# Altium project Temp_sense_Project 2.0.PrjPcb
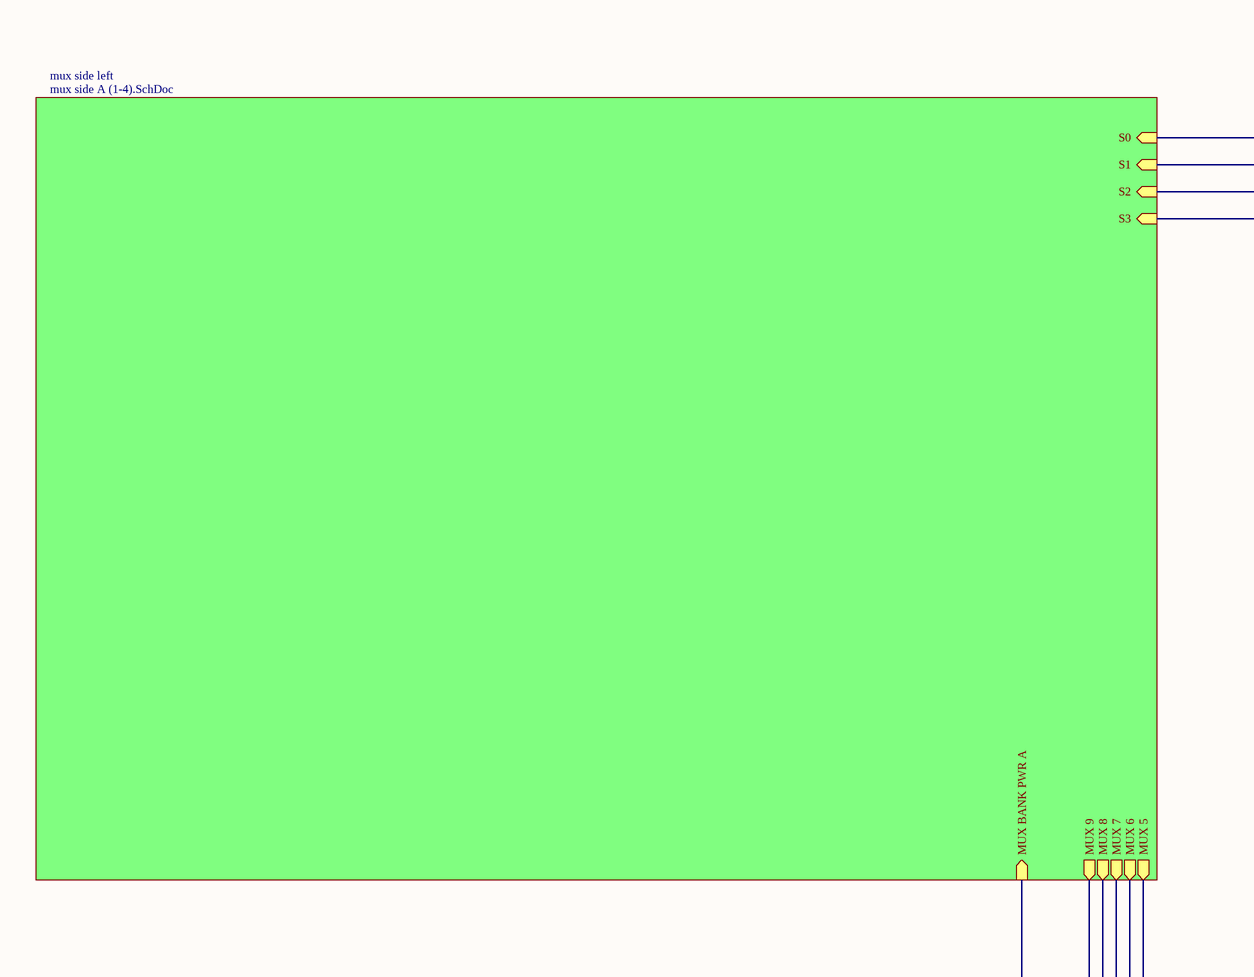
[diagram p0: temp sense 2.0 top.SchDoc, top left]
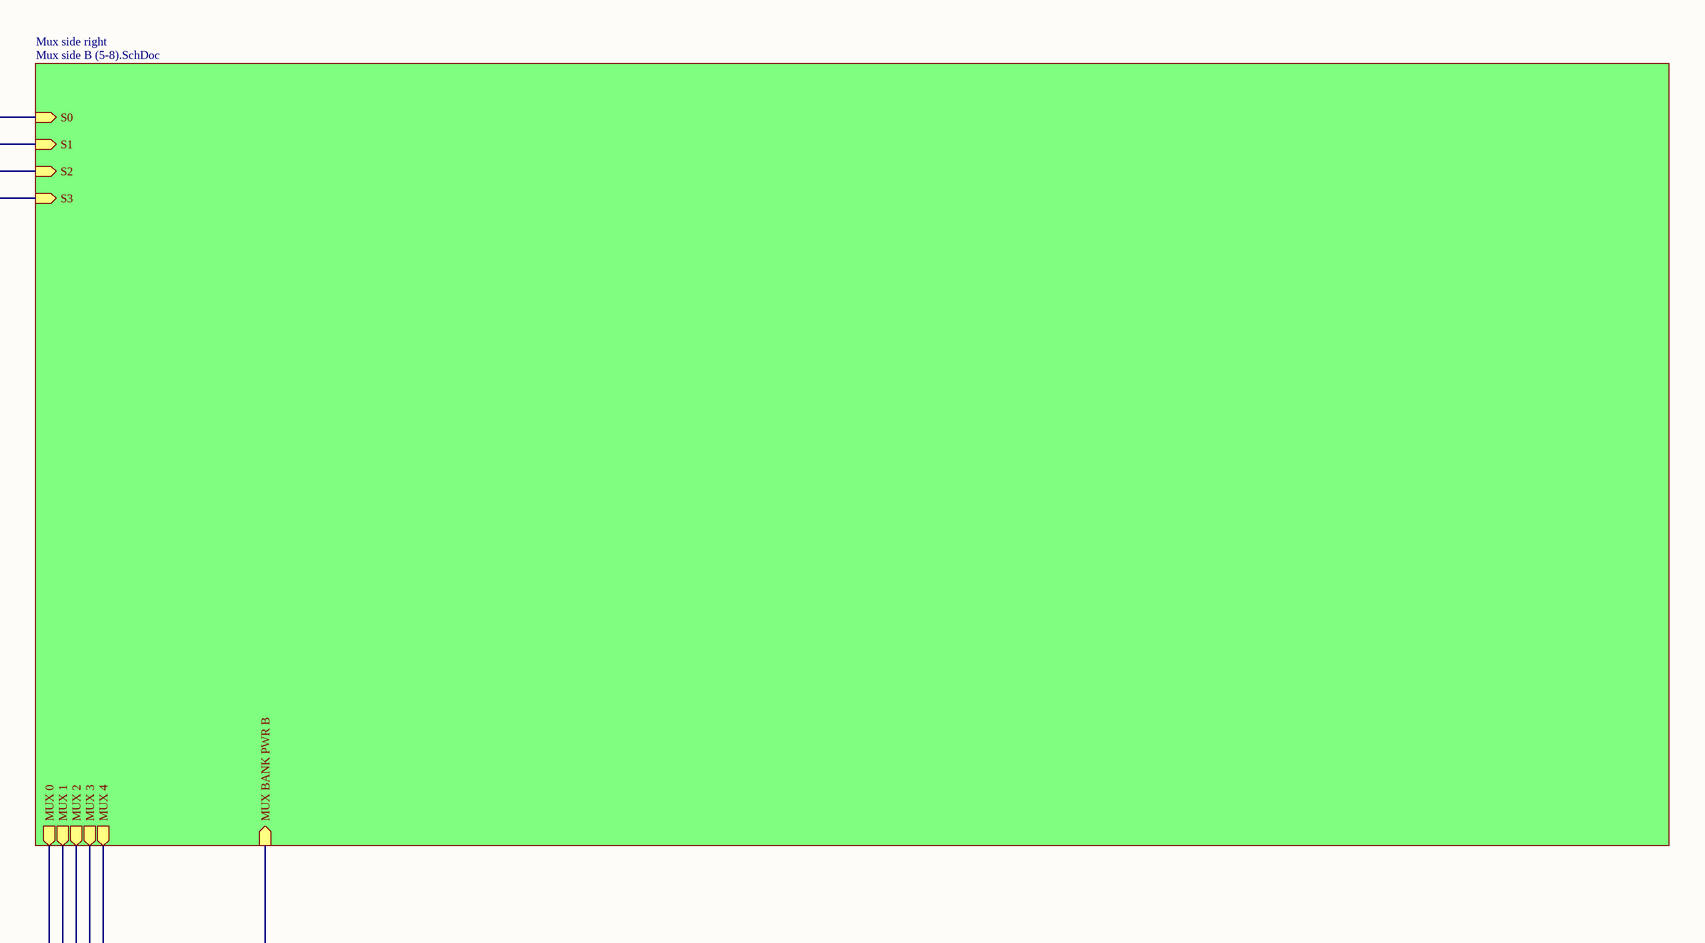
[diagram p1: temp sense 2.0 top.SchDoc, top right]
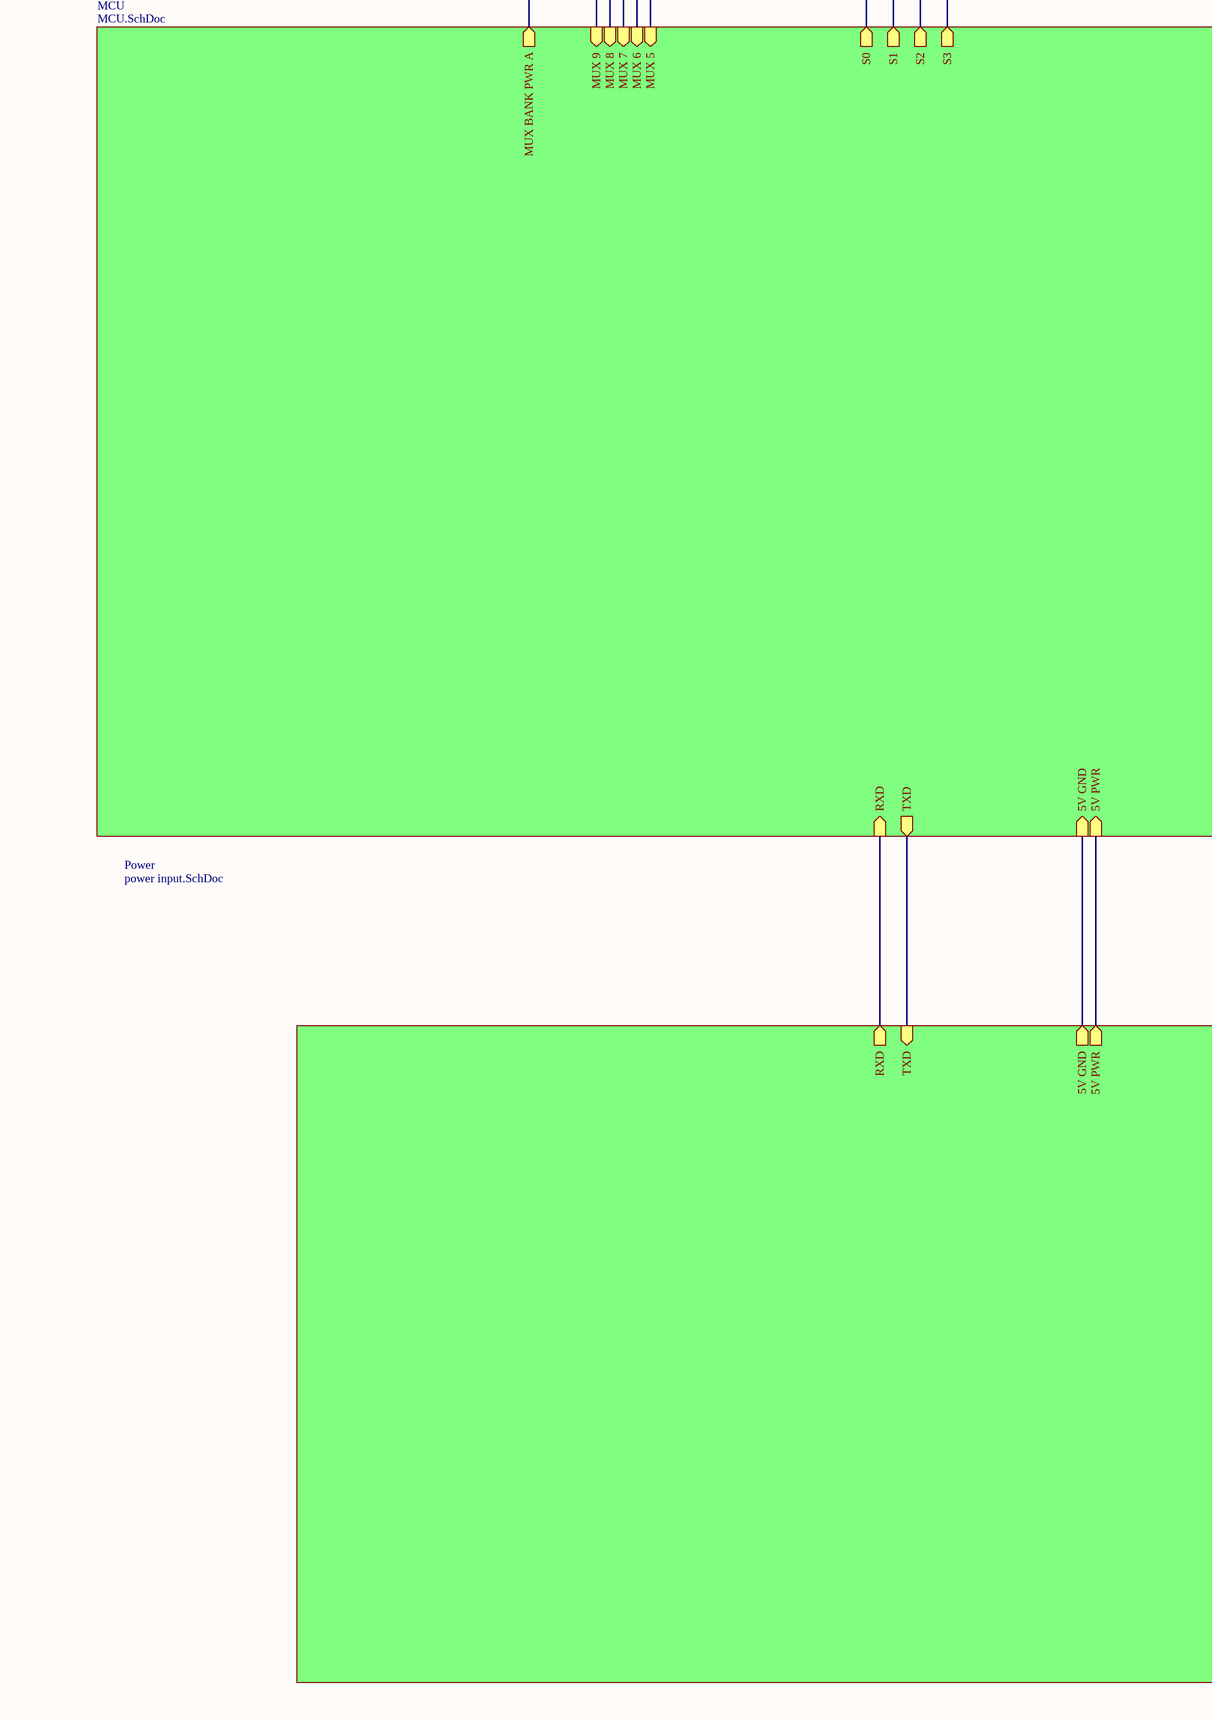
[diagram p2: temp sense 2.0 top.SchDoc, bottom left]
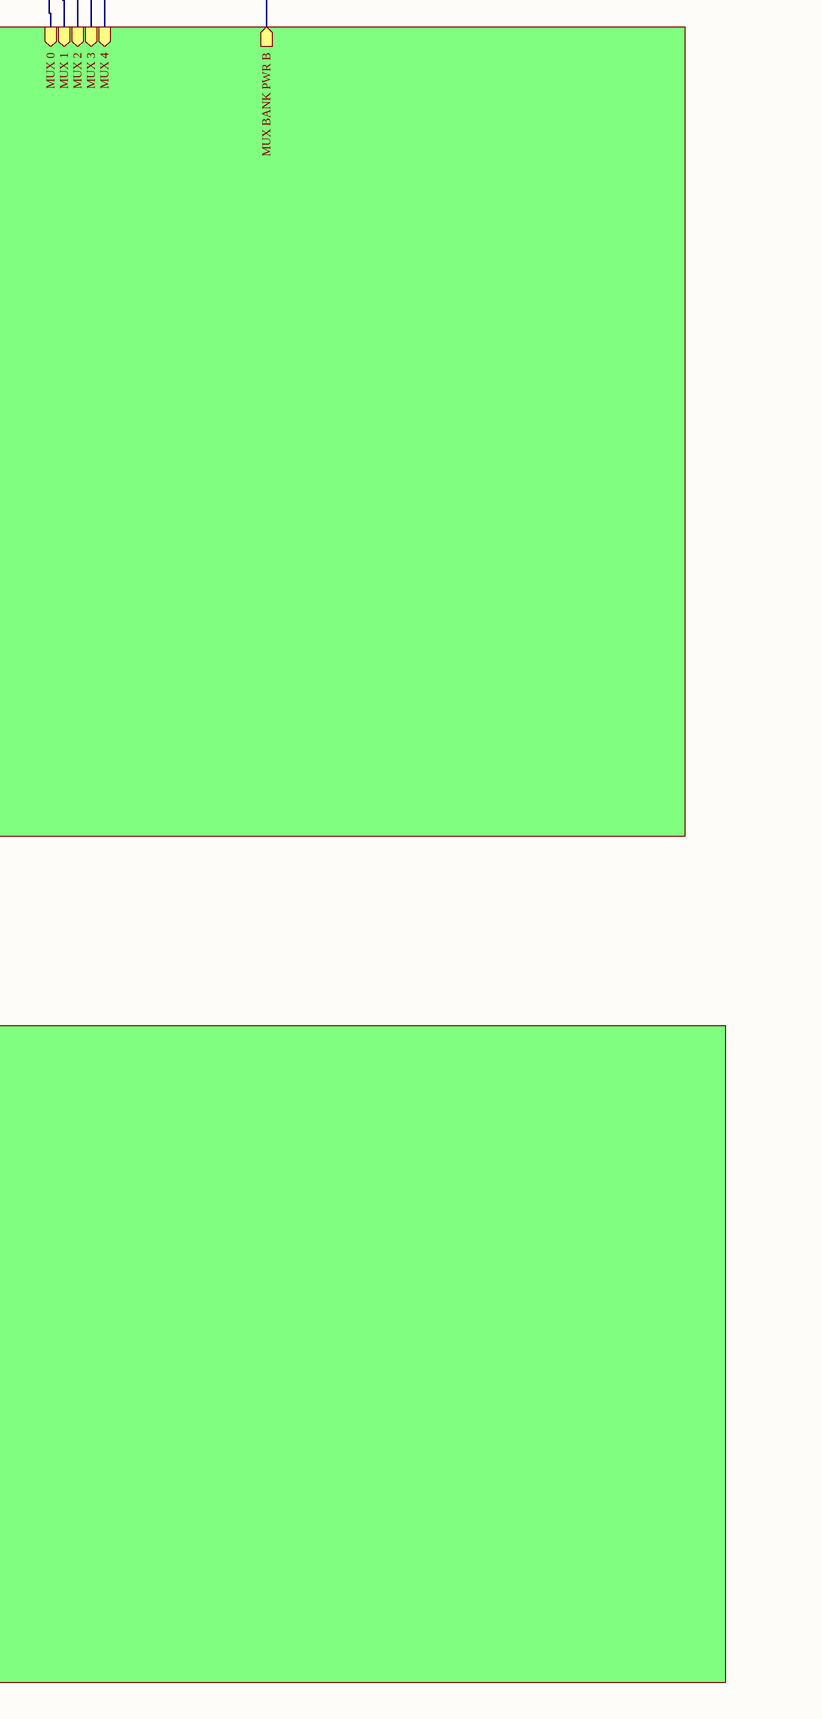
[diagram p3: temp sense 2.0 top.SchDoc, bottom right]
3 sheets, 35 parts. Net scope: hierarchical (ports join the sheet entries above them; power ports are global).
Board files: Temp_sense_Project 2.0(right angle.PcbDoc, temp sense 2.0,uhh.PcbDoc
Sheets:
  temp sense 2.0 top.SchDoc
    Power = power input.SchDoc
    MCU = MCU.SchDoc

## Sheet temp sense 2.0 top.SchDoc: 2026 Temp Sense blocks
size 863 x 558 mm; Date: 11/29/2025; Author: Mitchell Donahue; CompanyName: Lawrence Technological University; DrawnBy: Mitchell Donahue; Engineer: Mitchell Donahue; Organization: Blue Devil Motorsport; DocumentNumber: 1; Revision: 1; SheetNumber: 1; SheetTotal: 5; =Project: Temp sense; Application_BuildNumber: 1

### Sub-sheets
MCU = MCU.SchDoc: S0 (out), S1 (out), S2 (out), S3 (out), MUX 0 (in), MUX 1 (in), MUX 2 (in), MUX 3 (in), MUX 4 (in), MUX 5 (in), MUX 6 (in), MUX 7 (in), MUX 8 (in), MUX 9 (in), 5V GND (in), 5V PWR (in), MUX BANK PWR A (out), MUX BANK PWR B (out), TXD (out), RXD (in)
mux side left = mux side A (1-4).SchDoc (file not in this document): S0 (in), S1 (in), S2 (in), S3 (in), MUX 5 (out), MUX 6 (out), MUX 7 (out), MUX 8 (out), MUX 9 (out), MUX BANK PWR A (in)
Mux side right = Mux side B (5-8).SchDoc (file not in this document): S0 (in), S1 (in), S2 (in), S3 (in), MUX 0 (out), MUX 1 (out), MUX 2 (out), MUX 3 (out), MUX 4 (out), MUX BANK PWR B (in)
Power = power input.SchDoc: 5V GND (out), 5V PWR (out), RXD (out), TXD (in)

### Nets
GND: sheet Power/5V GND, sheet MCU/5V GND
NetC19_2: sheet Power/5V PWR, sheet MCU/5V PWR
NetC20_1: sheet Mux side right/MUX BANK PWR B, sheet mux side left/MUX BANK PWR A, sheet MCU/MUX BANK PWR A, sheet MCU/MUX BANK PWR B
NetU9_12: sheet Power/TXD, sheet MCU/TXD
NetU9_13: sheet Power/RXD, sheet MCU/RXD
NetU10_8: sheet mux side left/MUX 8, sheet MCU/MUX 8
NetU10_9: sheet mux side left/MUX 9, sheet MCU/MUX 9
NetU10_14: sheet Mux side right/MUX 0, sheet MCU/MUX 0
NetU10_15: sheet Mux side right/MUX 1, sheet MCU/MUX 1
NetU10_16: sheet Mux side right/MUX 2, sheet MCU/MUX 2
NetU10_17: sheet Mux side right/MUX 3, sheet MCU/MUX 3
NetU10_20: sheet Mux side right/MUX 4, sheet MCU/MUX 4
NetU10_21: sheet mux side left/MUX 5, sheet MCU/MUX 5
NetU10_22: sheet mux side left/MUX 6, sheet MCU/MUX 6
NetU10_23: sheet mux side left/MUX 7, sheet MCU/MUX 7
NetU10_29: sheet Mux side right/S3, sheet mux side left/S3, sheet MCU/S3
NetU10_55: sheet Mux side right/S0, sheet mux side left/S0, sheet MCU/S0
NetU10_56: sheet Mux side right/S2, sheet mux side left/S2, sheet MCU/S2
NetU10_57: sheet Mux side right/S1, sheet mux side left/S1, sheet MCU/S1

### Notes on the sheet
- DWG. NO.
- REV.
- SHT.
- REVISION
- DESCRIPTION
- DATE
- APPROVED
- THIS DOCUMENT AND THE DATA DISCLOSED HEREIN OR HEREWITH IS THE PROPERTY OF ALTIUM LIMITED AND MAY BE FREELY DISTRIBUTED IN WHOLE. NO RIGHTS ARE RESERVED OR EXPRESS OR IMPLIED WARANTEE GIVEN.
- ENG:
- DSN:
- APPROVALS
- PROJECT
- DOCUMENT REVISION:
- DESIGN ITEM:
- CHK:
- BOM:
- REFERENCE DOCUMENTS
- PROJECT REVISION:
- TITLE
- FAB DWG:
- PCB DWG:
- ASSY DWG:
- SCALE:
- SIZE
- D
- CAGE CODE
- FILE NAME
- DWG NO.
- SHEET
- OF
- REV

## Sheet power input.SchDoc
size 431 x 279 mm; SheetNumber: 4; SheetTotal: 5
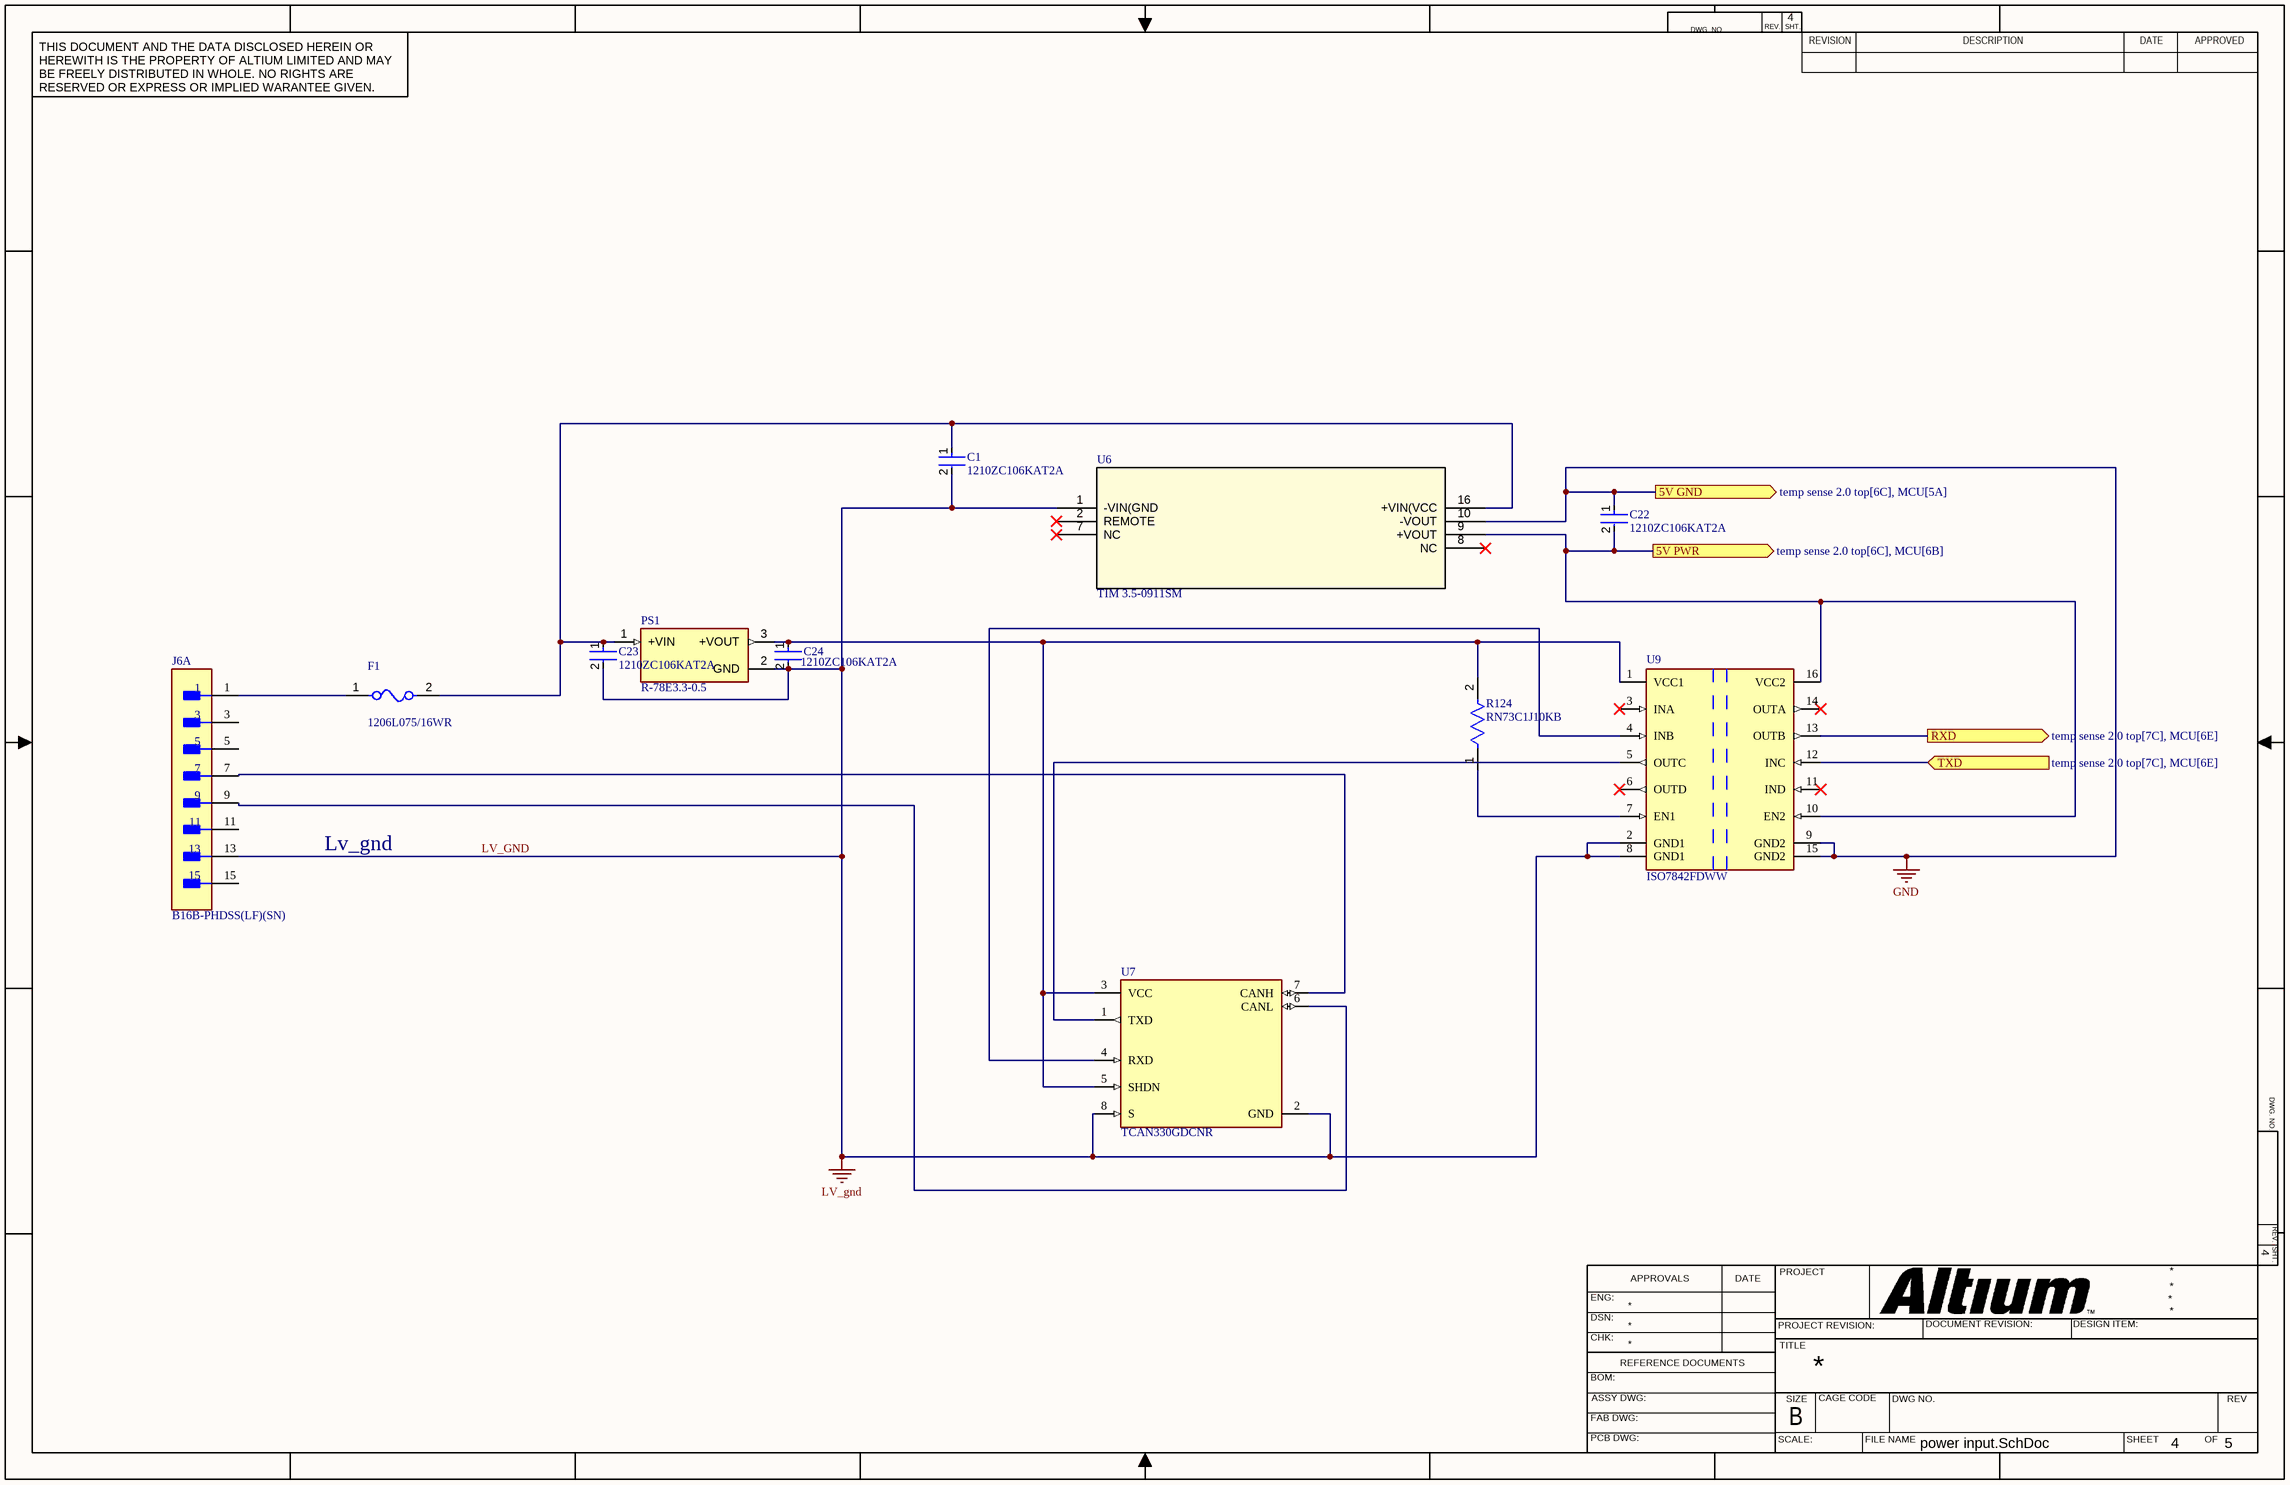
[diagram p4: power input.SchDoc]

### Parts
C1  1210ZC106KAT2A  [FP-1210-L_3_3_0_4-W_2_5_0-IPC_A]
C22  1210ZC106KAT2A  [FP-1210-L_3_3_0_4-W_2_5_0-IPC_A]
C23  1210ZC106KAT2A  [FP-1210-L_3_3_0_4-W_2_5_0-IPC_A]
C24  1210ZC106KAT2A  [FP-1210-L_3_3_0_4-W_2_5_0-IPC_A]
F1  1206L075/16WR  [FP-1206L-MFG]
J6  B16B-PHDSS(LF)(SN)  [FP-B16B-PHDSS_LF_SN-MFG]  (part A of 2)
PS1  R-78E3.3-0.5  [CONV_R-78E3.3-0.5]
R124  RN73C1J10KB  [FP-RN731J-MFG]
U6  TIM 3.5-0911SM  [TIM 3.5SM SINGLE_TRP]
U7  TCAN330GDCNR  [FP-DCN0008A-MFG]
U9  ISO7842FDWW  [FP-DWW0016A-MFG]

### Ports
5V GND (out, see temp sense 2.0 top[6C], MCU[5A]), 5V PWR (out, see temp sense 2.0 top[6C], MCU[6B]), RXD (out, see temp sense 2.0 top[7C], MCU[6E]), TXD (in, see temp sense 2.0 top[7C], MCU[6E])

### Nets
GND: C22.1 U6.10(-VOUT) U9.9(GND2) U9.15(GND2) ; port 5V GND
LV_GND: C1.2 C23.2 C24.2 J6.13 PS1.2(GND) U6.1(-VIN(GND) U7.2(GND) U7.8(S) U9.2(GND1) U9.8(GND1)
NetC1_1: C1.1 C23.1 F1.2 PS1.1(+VIN) U6.16(+VIN(VCC)
NetC19_2: C22.2 U6.9(+VOUT) U9.10(EN2) U9.16(VCC2) ; port 5V PWR
NetC24_1: C24.1 PS1.3(+VOUT) R124.2 U7.3(VCC) U7.5(SHDN) U9.1(VCC1)
NetF1_1: F1.1 J6.1
NetJ6_7: J6.7 U7.7(CANH)
NetJ6_9: J6.9 U7.6(CANL)
NetR124_1: R124.1 U9.7(EN1)
NetU7_1: U7.1(TXD) U9.5(OUTC)
NetU7_4: U7.4(RXD) U9.4(INB)
NetU9_12: U9.12(INC) ; port TXD
NetU9_13: U9.13(OUTB) ; port RXD

Not connected (* = marked no-connect by the designer): J6 3 5 11 15; U6 2(REMOTE)* 7(NC)* 8(NC)*; U9 3(INA)* 6(OUTD)* 11(IND)* 14(OUTA)*

### Notes on the sheet
- Lv_gnd
- DWG. NO.
- REV.
- SHT.
- THIS DOCUMENT AND THE DATA DISCLOSED HEREIN OR HEREWITH IS THE PROPERTY OF ALTIUM LIMITED AND MAY BE FREELY DISTRIBUTED IN WHOLE. NO RIGHTS ARE RESERVED OR EXPRESS OR IMPLIED WARANTEE GIVEN.
- REVISION
- DESCRIPTION
- DATE
- APPROVED
- ENG:
- APPROVALS
- PROJECT
- DSN:
- CHK:
- REFERENCE DOCUMENTS
- PROJECT REVISION:
- TITLE
- DOCUMENT REVISION:
- DESIGN ITEM:
- BOM:
- FAB DWG:
- PCB DWG:
- ASSY DWG:
- SCALE:
- SIZE
- B
- CAGE CODE
- FILE NAME
- DWG NO.
- SHEET
- OF
- REV

### Library data of the parts
C1 C22-C24 = CMP-1038-02198-3: CAP CER 10UF 10V X7R 1210; Dissipation Factor: 5%; Tolerance: 10%; Capacitance: 10uF; Voltage Rating (DC): 10V; Case Code (Imperial): 1210; Termination: SMD/SMT; Min Operating Temperature: -55°C; Max Operating Temperature: 125°C; Voltage: 10V; RoHS Compliant: Yes; Lead Free: Lead Free; Construction: Flat; Case/Package: 1210; Dielectric: X7R; Width: 0.098inch; REACH SVHC: No SVHC; Mount: Surface Mount; Case Code (Metric): 3225; Depth: 2.5mm; Series: 1210; Voltage Rating: 10V; Packaging: Tape and Reel; Length: 3.2mm; Thickness: 0.11inch; Package Quantity: 1; Height: 2.79mm; Radiation Hardening: No
F1 = CMP-08606-000003-1: PTC RESET FUSE 16V 750MA 1206; Manufacturer: Littelfuse Inc; Hold Current: 0.75A; Resistance: 0.09-0.29Ω; Value: 0.09-0.29Ω; Trip Time: 0.2s; Current Rating: 100A; Trip Current: 1.5A; Device Class L2: PTC Resettable Fuses; RoHS: TRUE; Temperature: -40°C to +85°C; ComponentLink2URL: https://www.littelfuse.com/~/media/electronics/datasheets/resettable_ptcs/littelfuse_ptc_1206l_datasheet.pdf.pdf; Voltage Rating: 16V; Category: Fuse; Manufacturer Part Number: 1206L075/16WR; Lead Free: Yes; Digikey Description: PTC RESET FUSE 16V 750MA 1206; Temperature Range Low: -40°C; Temperature Range High: +85°C; Octopart: https://octopart.com/1206l075%2F16wr-littelfuse-28867102; Package: 1206L; Device Class L1: Circuit Protection; Height: 1.25mm; ComponentLink2Description: Datasheet; Automotive: No; Mouser Description: Resettable Fuses - PPTC 16V 0.75A 1206 PTC; Device Class L3: unset
J6 = CMP-17439-000399-1: CONN HEADER VERT 16POS 2MM; Max Current Rating: 3A; Voltage Rating: 250V; Row Spacing: 0.079inch; Number of Contacts: 16; Mated Stacking Heights: 8.8mm; Contact Resistance: 20mR; Gender: Male; Contact Finish - Mating: TIN; Contact Mating Length: 0.114inch; Current Rating: 3A; Connector Type: Header; Insulation Material: Nylon; Packaging: Bulk; Max Voltage Rating (AC): 250V; Depth: 5mm; Number of Rows: 2; Length: 17.9mm; Width: 5mm; Mount: Through Hole; Contact Material: Copper Alloy; Pitch: 2mm; Insulation Color: Natural; Lead Free: Lead Free; Housing Material: Polyamide; Min Operating Temperature: -25°C; Max Operating Temperature: 85°C; Contact Type: Male Pin; Fastening Type: Detent; Height: 9.5mm; Color: Natural; Contact Shape: Square; Housing Color: Beige; Series: PHD; Number of Positions: 16; Orientation: Straight; Flammability Rating: UL94 V-0; Termination: Solder; Contact Plating: Copper
PS1 = R-78E3.3-0.5: 0.5A DC/DC-Converter 'INNOLINE' SIP3 reg; MF: Recom Power; Check_prices: https://www.snapeda.com/parts/R-78E3.3-0.5/Recom+Power/view-part/?ref=eda; Value: *; MP: R-78E3.3-0.5; Purchase-URL: https://pricing.snapeda.com/search/part/R-78E3.3-0.5/?ref=eda; SnapEDA_Link: https://www.snapeda.com/parts/R-78E3.3-0.5/Recom+Power/view-part/?ref=snap; Package: SIP-3 Recom Power; Digi-Key_Part_Number: 945-1661-5-ND
R124 = CMP-03211-006130-1: Thin Film Resistors RN 0603 10KΩ 0.1% 10ppm/°C; Manufacturer: TE Connectivity; Voltage Rating: 50V; Power Rating: 0.063W; Octopart: https://octopart.com/rn73c1j10kb-te+connectivity-47108040; RoHS: TRUE; Value: 10KΩ; Device Class L1: Passive Components; Manufacturer Part Number: RN73C1J10KB; ComponentLink2URL: https://www.te.com/commerce/DocumentDelivery/DDEController?Action=showdoc&DocId=Data+Sheet%7F1773270%7FP%7Fpdf%7FEnglish%7FENG_DS_1773270_P.pdf%7F9-1614352-9; Resistance: 10KΩ; Temperature Coefficient: 10ppm/°C; Device Class L2: Resistors; Temperature Range High: +155°C; Temperature: -55°C to +155°C; Series: RN73; Height: 0.55mm; Package: RN731J; octopart_url: https://octopart.com/rn73c1j10kb-te+connectivity-47108040; ComponentLink2Description: Datasheet; Temperature Range Low: -55°C; Composition: Thin Film; Ipc Land Pattern Name: RESC15580X45; Automotive: No; Lead Free: Yes; Device Class L3: Chip SMD Resistors; Category: Res; Tolerance: 0.1%
U6 = CMP-01539-89931857-1: TIM 3.5-0911SM 3.5 Watt DC/DC converter, medical, 4: 1 input, 5000 VAC I/O-isolation (2 x MOPP), low leakage current, encapsulated,...; Output Power: 3.5W; Number of Outputs: 1; NexarPartId: 89931857; Height: 10.5mm; Width: 14.4mm; RoHS: Compliant
U7 = CMP-04872-000178-1: IC TRANSCEIVER 1/1 SOT23-8; Data Rate: 1Mbps; Packaging: Tape and Reel; Min Operating Temperature: -40°C; Max Operating Temperature: 125°C; RoHS Compliant: Yes; Lead Free: Lead Free; Case/Package: SOT-23-8; Mount: Surface Mount
U9 = CMP-04872-000209-1: DGTL ISO 5700VRMS 4CH GP 16SOIC; Min Supply Voltage: 2.25V; Pulse Width Distortion (PWD): 4.1ns; Channel Type: Unidirectional; Number of Channels: 4; Max Supply Voltage: 5.5V; Isolated Power: No; Propagation Delay: 16ns; Data Rate: 100Mbps; Type: General Purpose; Packaging: Rail/Tube; REACH SVHC: No SVHC; Number of Pins: 16; Max Operating Temperature: 125°C; Case/Package: SOIC; RoHS Compliant: Yes; Min Operating Temperature: -55°C; Lead Free: Lead Free

## Sheet MCU.SchDoc: 2026 temp sense-mcu
size 431 x 279 mm; Date: 11/29/2025; Author: Mitchell Donahue; CompanyName: Lawrence Technological University; DrawnBy: Mitchell Donahue; Engineer: Mitchell Donahue; Organization: Blue Devil Motorsports; DocumentNumber: 5; Revision: 1.5; SheetNumber: 5; SheetTotal: 5
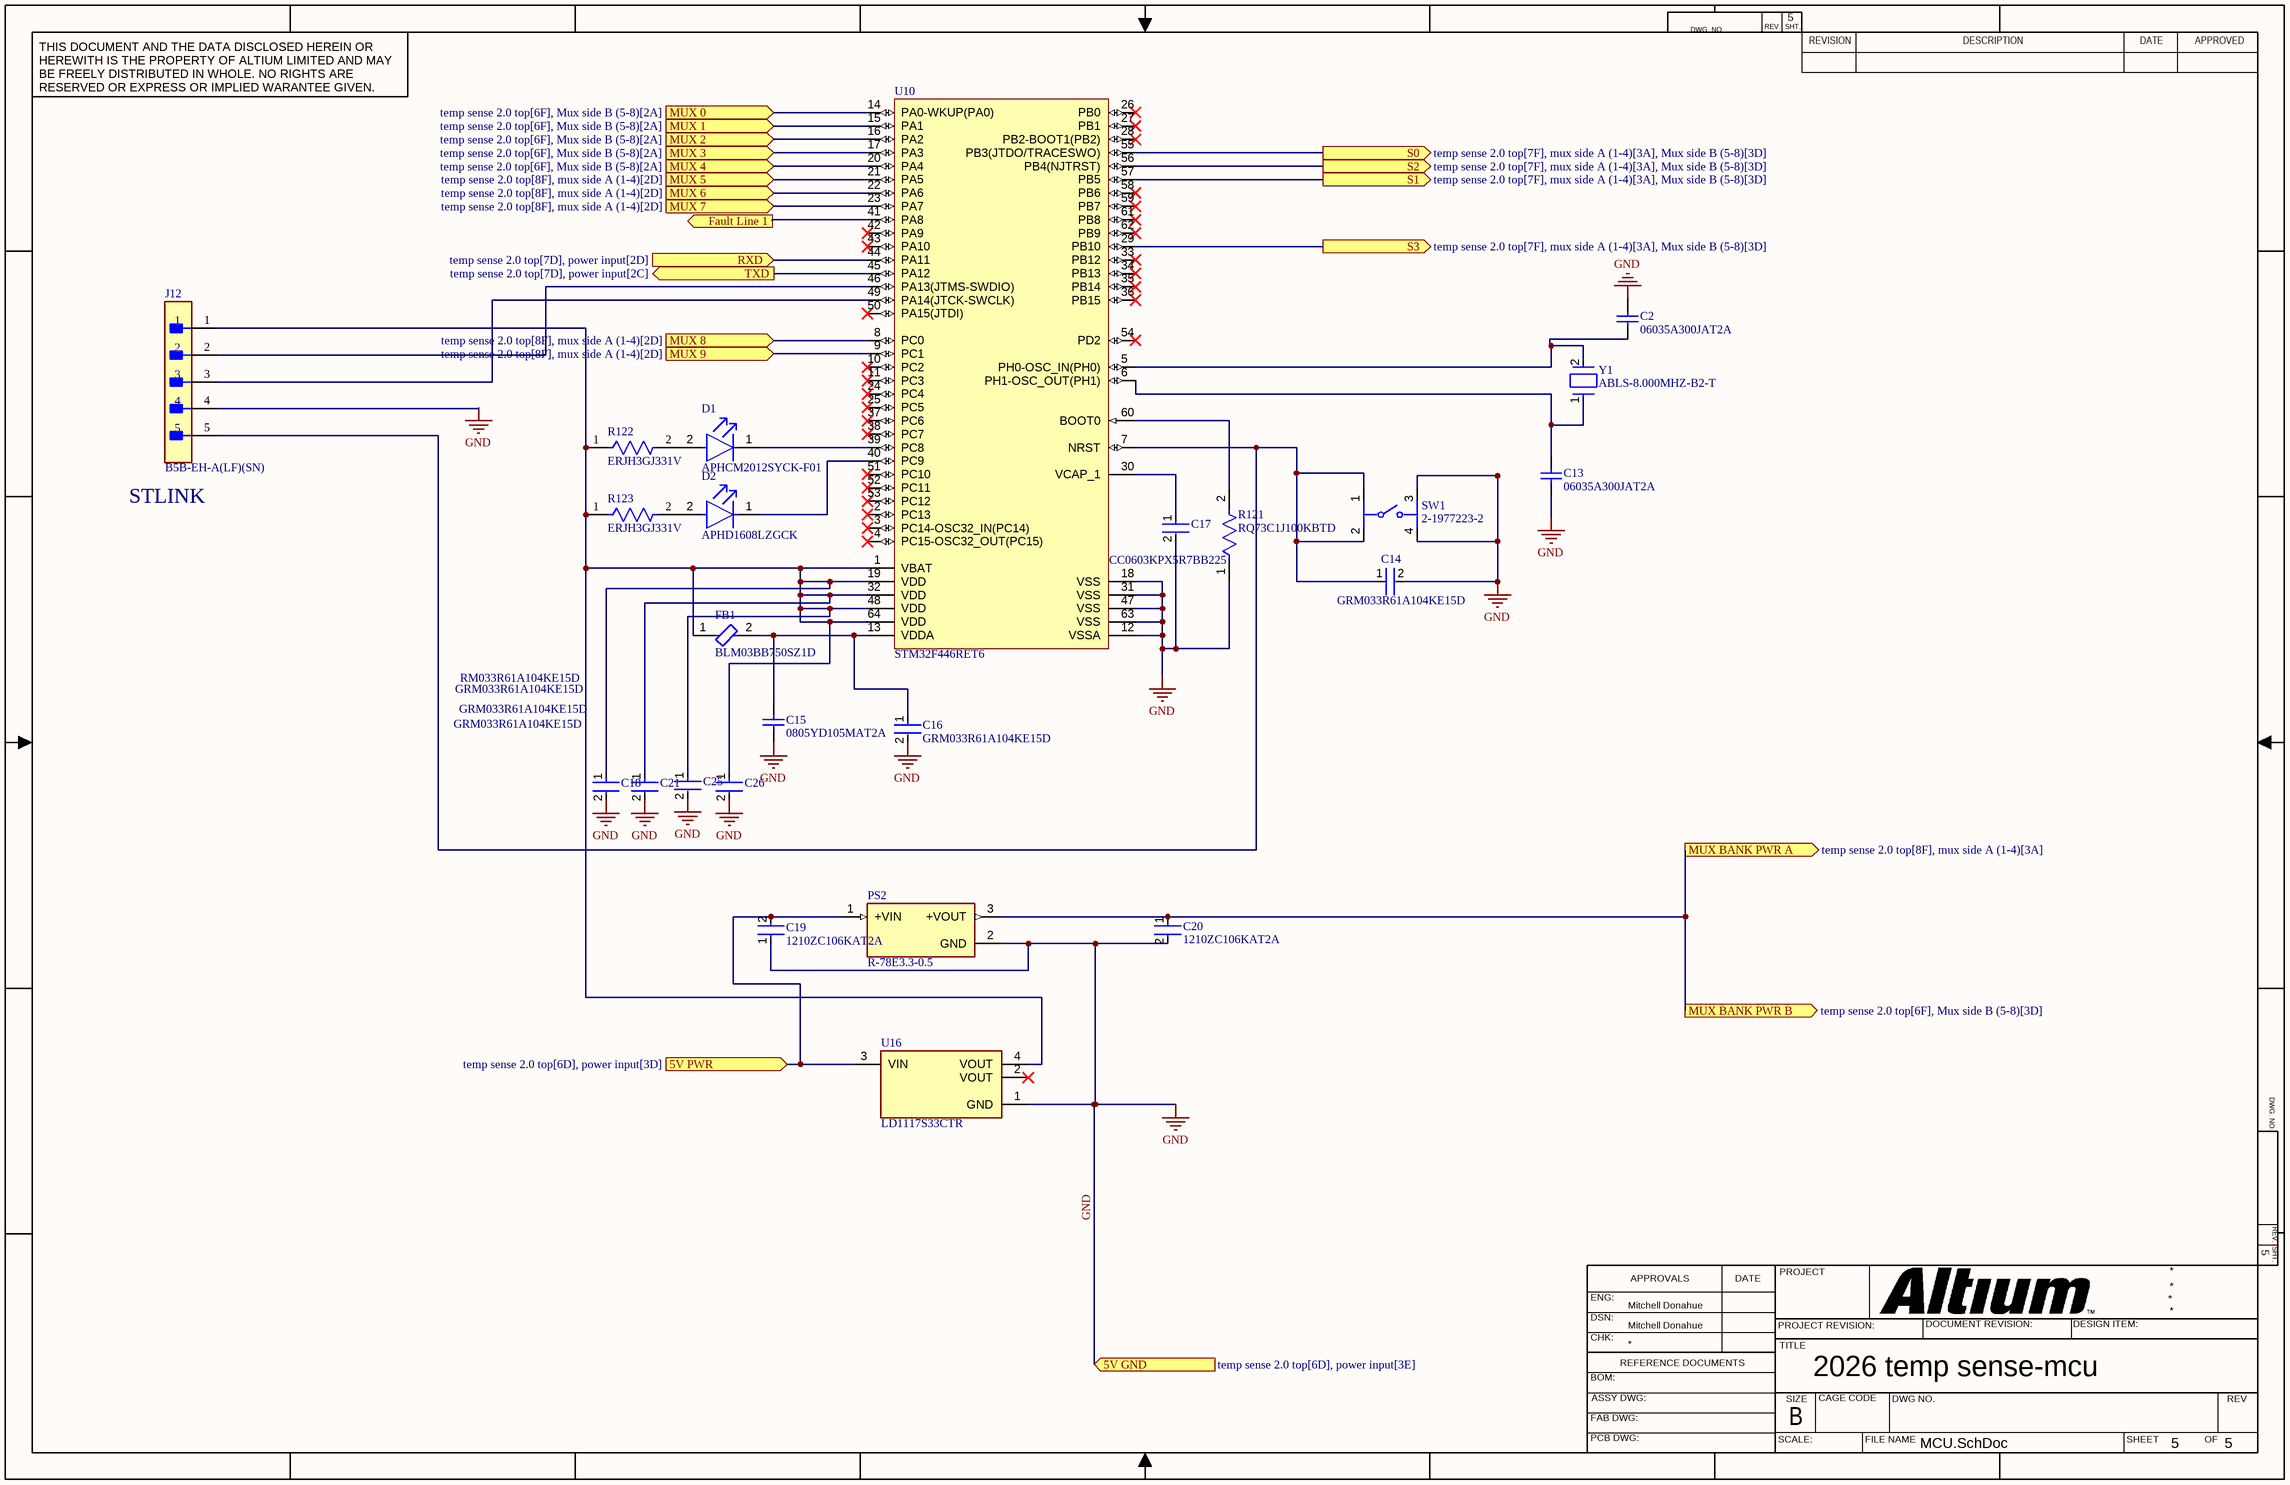
[diagram p5: MCU.SchDoc]

### Parts
C2  06035A300JAT2A  [CAPC1608X90X35LL15T15]
C13  06035A300JAT2A  [CAPC1608X90X35LL15T15]
C14  GRM033R61A104KE15D  [FP-GRM033-0_03-IPC_C]
C15  0805YD105MAT2A  [CAPC2013X140X50NL20T25]
C16  GRM033R61A104KE15D  [FP-GRM033-0_03-IPC_C]
C17  CC0603KPX5R7BB225  [FP-CC0603-DA-MFG]
C18  GRM033R61A104KE15D  [FP-GRM033-0_03-IPC_C]
C19  1210ZC106KAT2A  [FP-1210-L_3_3_0_4-W_2_5_0-IPC_A]
C20  1210ZC106KAT2A  [FP-1210-L_3_3_0_4-W_2_5_0-IPC_A]
C21  RM033R61A104KE15D  [FP-GRM033-0_03-IPC_C]
C25  GRM033R61A104KE15D  [FP-GRM033-0_03-IPC_C]
C26  GRM033R61A104KE15D  [FP-GRM033-0_03-IPC_C]
D1  APHCM2012SYCK-F01  [FP-APHCM2012SYCK-F01-MFG]
D2  APHD1608LZGCK  [FP-APHD1608LZGCK-MFG]
FB1  BLM03BB750SZ1D  [FP-BLM03-0_03-d0_3-IPC_C]
J12  B5B-EH-A(LF)(SN)  [FP-B5B-EH-A_LF_SN-MFG]
PS2  R-78E3.3-0.5  [CONV_R-78E3.3-0.5]
R121  RQ73C1J100KBTD  [FP-RQ731J-IPC_C]
R122  ERJH3GJ331V  [FP-ERJH3G-MFG]
R123  ERJH3GJ331V  [FP-ERJH3G-MFG]
SW1  2-1977223-2  [FP-2-1977223-2-MFG]
U10  STM32F446RET6  [STM-LQFP64_L]
U16  LD1117S33CTR  [FP-SOT-223-0046067_14-MFG]
Y1  ABLS-8.000MHZ-B2-T  [FP-ABLS-MFG]

### Ports
5V GND (in, see temp sense 2.0 top[6D], power input[3E]), 5V PWR (in, see temp sense 2.0 top[6D], power input[3D]), Fault Line 1 (out), MUX 0 (in, see temp sense 2.0 top[6F], Mux side B (5-8)[2A]), MUX 1 (in, see temp sense 2.0 top[6F], Mux side B (5-8)[2A]), MUX 2 (in, see temp sense 2.0 top[6F], Mux side B (5-8)[2A]), MUX 3 (in, see temp sense 2.0 top[6F], Mux side B (5-8)[2A]), MUX 4 (in, see temp sense 2.0 top[6F], Mux side B (5-8)[2A]), MUX 5 (in, see temp sense 2.0 top[8F], mux side A (1-4)[2D]), MUX 6 (in, see temp sense 2.0 top[8F], mux side A (1-4)[2D]), MUX 7 (in, see temp sense 2.0 top[8F], mux side A (1-4)[2D]), MUX 8 (in, see temp sense 2.0 top[8F], mux side A (1-4)[2D]), MUX 9 (in, see temp sense 2.0 top[8F], mux side A (1-4)[2D]), MUX BANK PWR A (out, see temp sense 2.0 top[8F], mux side A (1-4)[3A]), MUX BANK PWR B (out, see temp sense 2.0 top[6F], Mux side B (5-8)[3D]), RXD (in, see temp sense 2.0 top[7D], power input[2D]), S0 (out, see temp sense 2.0 top[7F], mux side A (1-4)[3A], Mux side B (5-8)[3D]), S1 (out, see temp sense 2.0 top[7F], mux side A (1-4)[3A], Mux side B (5-8)[3D]), S2 (out, see temp sense 2.0 top[7F], mux side A (1-4)[3A], Mux side B (5-8)[3D]), S3 (out, see temp sense 2.0 top[7F], mux side A (1-4)[3A], Mux side B (5-8)[3D]), TXD (out, see temp sense 2.0 top[7D], power input[2C])

### Nets
GND: C2.2 C13.1 C14.2 C15.1 C16.2 C17.2 C18.2 C19.1 C20.2 C21.2 C25.2 C26.2 J12.4 PS2.2(GND) R121.1 SW1.3 SW1.4 U10.12(VSSA) U10.18(VSS) U10.31(VSS) U10.47(VSS) U10.63(VSS) U16.1(GND) ; port 5V GND
NetC2_1: C2.1 U10.5(PH0-OSC_IN(PH0)) Y1.2
NetC13_2: C13.2 U10.6(PH1-OSC_OUT(PH1)) Y1.1
NetC14_1: C14.1 J12.5 SW1.1 SW1.2 U10.7(NRST)
NetC15_2: C15.2 C16.1 FB1.2 U10.13(VDDA)
NetC17_1: C17.1 U10.30(VCAP_1)
NetC18_1: C18.1 C21.1 C25.1 C26.1 FB1.1 J12.1 R122.1 R123.1 U10.1(VBAT) U10.19(VDD) U10.32(VDD) U10.48(VDD) U10.64(VDD) U16.4(VOUT)
NetC19_2: C19.2 PS2.1(+VIN) U16.3(VIN) ; port 5V PWR
NetC20_1: C20.1 PS2.3(+VOUT) ; port MUX BANK PWR A, port MUX BANK PWR B
NetD1_1: D1.1(C) U10.39(PC8)
NetD1_2: D1.2(A) R122.2
NetD2_1: D2.1(C) U10.40(PC9)
NetD2_2: D2.2(A) R123.2
NetJ12_2: J12.2 U10.46(PA13(JTMS-SWDIO))
NetJ12_3: J12.3 U10.49(PA14(JTCK-SWCLK))
NetR121_2: R121.2 U10.60(BOOT0)
NetU9_12: U10.45(PA12) ; port TXD
NetU9_13: U10.44(PA11) ; port RXD
NetU10_8: U10.8(PC0) ; port MUX 8
NetU10_9: U10.9(PC1) ; port MUX 9
NetU10_14: U10.14(PA0-WKUP(PA0)) ; port MUX 0
NetU10_15: U10.15(PA1) ; port MUX 1
NetU10_16: U10.16(PA2) ; port MUX 2
NetU10_17: U10.17(PA3) ; port MUX 3
NetU10_20: U10.20(PA4) ; port MUX 4
NetU10_21: U10.21(PA5) ; port MUX 5
NetU10_22: U10.22(PA6) ; port MUX 6
NetU10_23: U10.23(PA7) ; port MUX 7
NetU10_29: U10.29(PB10) ; port S3
NetU10_41: U10.41(PA8) ; port Fault Line 1
NetU10_55: U10.55(PB3(JTDO/TRACESWO)) ; port S0
NetU10_56: U10.56(PB4(NJTRST)) ; port S2
NetU10_57: U10.57(PB5) ; port S1

Not connected (* = marked no-connect by the designer): U10 2(PC13)* 3(PC14-OSC32_IN(PC14))* 4(PC15-OSC32_OUT(PC15))* 10(PC2)* 11(PC3)* 24(PC4)* 25(PC5)* 26(PB0)* 27(PB1)* 28(PB2-BOOT1(PB2))* 33(PB12)* 34(PB13)* 35(PB14)* 36(PB15)* 37(PC6)* 38(PC7)* 42(PA9)* 43(PA10)* 50(PA15(JTDI))* 51(PC10)* 52(PC11)* 53(PC12)* 54(PD2)* 58(PB6)* 59(PB7)* 61(PB8)* 62(PB9)*; U16 2(VOUT)*

### Notes on the sheet
- (near J12) STLINK
- DWG. NO.
- REV.
- SHT.
- THIS DOCUMENT AND THE DATA DISCLOSED HEREIN OR HEREWITH IS THE PROPERTY OF ALTIUM LIMITED AND MAY BE FREELY DISTRIBUTED IN WHOLE. NO RIGHTS ARE RESERVED OR EXPRESS OR IMPLIED WARANTEE GIVEN.
- REVISION
- DESCRIPTION
- DATE
- APPROVED
- ENG:
- APPROVALS
- PROJECT
- DSN:
- CHK:
- REFERENCE DOCUMENTS
- PROJECT REVISION:
- TITLE
- DOCUMENT REVISION:
- DESIGN ITEM:
- BOM:
- FAB DWG:
- PCB DWG:
- ASSY DWG:
- SCALE:
- SIZE
- B
- CAGE CODE
- FILE NAME
- DWG NO.
- SHEET
- OF
- REV

### Library data of the parts
C2 C13 = CMP-2006-04292-1: Manufacturer: AVX Interconnect / Elco; Part Number: 06035A300JAT2A
C14 C16 C18 C21 C25 C26 = CMP-2010-01264-2: Chip Multilayer Ceramic Capacitors for General Purpose, 0201, 0.10uF, X5R, 15%, 10%, 10V; Capacitance: 100nF; Mount: Surface Mount; Dielectric: X5R; Width: 0.012inch; Tolerance: 10%; Radiation Hardening: No; Voltage Rating: 10V; REACH SVHC: No SVHC; Height: 0.3mm; Max Operating Temperature: 85°C; Voltage Rating (DC): 10V; Thickness: 0.013inch; Termination: SMD/SMT; Lead Free: Lead Free; Package Quantity: 1; Case/Package: 0201; Min Operating Temperature: -55°C; Weight: 6E-06oz; Length: 0.6mm; Case Code (Imperial): 0201; Depth: 0.3mm; Voltage: 10V; Packaging: Tape and Reel; Case Code (Metric): 0603
C15 = CMP-2007-04663-1: Manufacturer: AVX Interconnect / Elco; Part Number: 0805YD105MAT2A
C17 = CMP-03422-000187-1: CC0603 2.2 uF X5R 10.00% 16 V; Manufacturer: YAGEO; Value: 2.2 uF; Voltage Rating: 16 V; Material: Ceramic; Tolerance: 0.1; Temperature Coefficient: 15%; ComponentLink2Description: Datasheet; Device Class L3: Ceramic Capacitors; Temperature Characteristic: X5R; Package: CC0603-DA; Automotive: No; Manufacturer Part Number: CC0603KPX5R7BB225; Device Class L1: Passive Components; ComponentLink2URL: http://www.yageo.com/documents/recent/UPY-GPHC_X7R_6.3V-to-50V_18.pdf; RoHS: TRUE; Height: 0.9mm; Temperature Range High: +125°C; Footprint Url: http://www.yageo.com/exep/pages/download/literatures/UPY-C_GEN_24.pdf; Lead Free: Yes; Temperature Range Low: -55°C; Capacitance: 2.2 uF; Octopart: https://octopart.com/cc0603kpx5r7bb225-yageo-91091799; Device Class L2: Capacitors; Voltage: 16 V; Temperature: -55°C to +125°C; Category: Cap
C19 C20 = CMP-1038-02198-3: as C1 on sheet power input; Capacitance: 10uF; Voltage Rating (DC): 10V; Case Code (Imperial): 1210; Termination: SMD/SMT; Min Operating Temperature: -55°C; Max Operating Temperature: 125°C; Voltage: 10V; RoHS Compliant: Yes; Lead Free: Lead Free; Construction: Flat; Case/Package: 1210; Dielectric: X7R; Width: 0.098inch; REACH SVHC: No SVHC; Mount: Surface Mount; Case Code (Metric): 3225; Depth: 2.5mm; Series: 1210; Voltage Rating: 10V; Packaging: Tape and Reel; Length: 3.2mm; Thickness: 0.11inch; Package Quantity: 1; Height: 2.79mm; Radiation Hardening: No
D1 = CMP-44529-000064-1: LED YELLOW CLEAR CHIP SMD; Number of LEDs: 1; Luminous Intensity: 150mcd; Dominant Wavelength: 590nm; Test Current: 20mA; Illumination Color: Green; Forward Voltage: 2V; Viewing Angle: 110°; Number of Pins: 2; Packaging: Tape and Reel; Width: 1.25mm; Height: 0.4mm; Lens Color: Clear; RoHS Compliant: Yes; Lead Free: Lead Free; Min Operating Temperature: -40°C; Case Code (Imperial): 0805; Case/Package: 0805; Series: APHCM; Wavelength: 590nm; Max Operating Temperature: 85°C; Length: 2mm; Color: Yellow; Package Quantity: 2000; Mount: Surface Mount; Lens Style: Clear; Forward Current: 20mA; Case Code (Metric): 2012
D2 = CMP-44529-000045-1: LED GREEN CLEAR 1608 SMD; Test Current: 2mA; Dominant Wavelength: 525nm; Lens Color: Colorless; Luminous Intensity: 180mcd; Viewing Angle: 100°; Forward Voltage: 2.65V; Lens Size: 0.7mm; Lens Style: Round; Mount: Surface Mount; Packaging: Tape and Reel; Lens Transparency: Clear; Height: 0.75mm; Case/Package: 0603; Length: 1.6mm; Case Code (Metric): 1608; Width: 0.8mm; Color: Green; Case Code (Imperial): 0603
FB1 = CMP-06046-002018-1: Ferrite Bead, 0201, 75Ω @ 100MHz, 25%, 1Ω, 200mA; DC Resistance (DCR): 1R; Number of Lines: 1; Ratings: AEC-Q200; Max Current Rating: 200mA; Min Operating Temperature: -55°C; Max Operating Temperature: 125°C; RoHS Compliant: Yes; Case/Package: 0201; Mount: Surface Mount
J12 = CMP-17439-000382-1: CONN HEADER VERT 5POS 2.5MM; Number of Contacts: 5; Mated Stacking Heights: 8.1mm; Current Rating: 3A; Gender: Male; Voltage Rating: 250V; Lead Free: Lead Free; Fastening Type: Friction; Contact Type: Male Pin; Insulation Color: Natural; Insulation Material: Nylon; Contact Material: Brass; Contact Mating Length: 0.13inch; Pitch: 2.5mm; Number of Positions: 5; Number of Rows: 1; Connector Type: Header; Color: Natural; Contact Shape: Square; Flammability Rating: UL94 V-0; Orientation: Straight; Packaging: Bulk; Mount: Through Hole; Contact Finish - Mating: TIN; Contact Plating: Tin; Series: EH; Termination: Solder; Housing Color: White
PS2 = R-78E3.3-0.5: as PS1 on sheet power input; Check_prices: https://www.snapeda.com/parts/R-78E3.3-0.5/Recom+Power/view-part/?ref=eda; Value: *; MP: R-78E3.3-0.5; Purchase-URL: https://pricing.snapeda.com/search/part/R-78E3.3-0.5/?ref=eda; SnapEDA_Link: https://www.snapeda.com/parts/R-78E3.3-0.5/Recom+Power/view-part/?ref=snap; Package: SIP-3 Recom Power; Digi-Key_Part_Number: 945-1661-5-ND
R121 = CMP-03211-001316-1: RQ73 0603 100KΩ  0.15W 10ppm/°C 0.1% 75V; Manufacturer: TE; Automotive Grade: Grade 0; Device Class L3: Chip SMD Resistors; Composition: Thin Film; Category: Res; Device Class L2: Resistors; Automotive: Yes; Temperature Range High: +155°C; Resistance: 100KΩ; Octopart: https://octopart.com/rq73c1j100kbtd-te+connectivity-93908182; Temperature Range Low: -55°C; Device Class L1: Passive Components; Tolerance: 0.1%; ComponentLink2Description: Datasheet; Temperature: -55°C to +155°C; Value: 100KΩ; Ipc Land Pattern Name: RESC15580X45; Series: RQ73; Package: RQ731J; Manufacturer Part Number: RQ73C1J100KBTD; ComponentLink2URL: https://www.te.com/commerce/DocumentDelivery/DDEController?Action=showdoc&DocId=Data+Sheet%7F1773270-2%7FA%7Fpdf%7FEnglish%7FENG_DS_1773270-2_A.pdf%7F4-2176362-2; Height: 0.6mm; Power Rating: 0.15W; Lead Free: Yes; Temperature Coefficient: 10ppm/°C; Voltage Rating: 75V; RoHS: TRUE
R122 R123 = CMP-00287-116338145-1: ERJH3GJ331V Res 330 Ohm 5% 1/8W 0603; NexarPartId: 116338145
SW1 = CMP-03407-000026-1: SWITCH TACTILE SPST-NO 0.05A 24V; RoHS Compliant: Yes
U10 = CMP-0243-00218-1: ARM Cortex-M4 32-bit MCU+FPU, 512 KB Flash, 128 KB Internal RAM, 50 I/Os, 64-Pin LQFP, -40 to 85 degC, Tray; I/Os (High Current): 50; Supply Voltage(Vcc) min (V): 1.7; Operating Frequency(F) (Processor speed) (MHz): 180; D/A Converter: 2; Internal RAM Size (kB): 128; FLASH Size (Prog) (kB): 512; Core: ARM Cortex-M4; ComponentLink1Description: Manufacturer URL; Package Reference: 64-Pin Low-profile Quad Flat Package, Body 10 x 10 mm, Pitch 0.5 mm; ComponentLink2URL: http://www.st.com/st-web-ui/static/active/en/resource/technical/document/datasheet/DM00141306.pdf; Packing: Tray; DatasheetVersion: Rev. 6; ComponentLink1URL: http://www.st.com/; ComponentLink2Description: Datasheet; Package Description: LQFP64; Mounting Technology: Surface Mount
U16 = CMP-0244-00307-2: IC REG LINEAR 3.3V 800MA SOT223; Input Bias Current: 5mA; Output Voltage Accuracy: 1%; Dropout Voltage: 1.1V; Power Dissipation: 12W; Polarity: Positive; Min Input Voltage: 5.3V; Quiescent Current: 10mA; Max Output Current: 1.3A; Output Current: 950mA; Number of Regulators: 1; Max Supply Voltage: 15V; Output Type: Fixed; Output Voltage: 3.3V; Number of Terminals: 4; Min Supply Voltage: 3.3V; Termination: SMD/SMT; Mount: Surface Mount; Max Power Dissipation: 12W; Case/Package: SOT-223; Lead Free: Lead Free; Height: 1.8mm; REACH SVHC: No SVHC; Radiation Hardening: No; Width: 3.5mm; Length: 6.5mm; Packaging: Tape and Reel; Max Input Voltage: 15V; Accuracy: 1%; Weight: 0.01lb; Contact Plating: Tin; Max Operating Temperature: 125°C; Number of Pins: 4; Max Output Voltage: 3.3V; Min Operating Temperature: -40°C; Nominal Output Voltage: 3.3V; Package Quantity: 1; Min Output Voltage: 3.3V; Number of Outputs: 1
Y1 = CMP-27762-009874-1: CRYSTAL 8.0000MHZ 18PF SMD; ESR (Equivalent Series Resistance): 80R; Operating Frequency: 8 MHz; Frequency Stability: 50ppm; Tolerance: 20ppm; Frequency: 8MHz; Min Operating Temperature: -20°C; Lead Free: Lead Free; Width: 4.7mm; Packaging: Tape and Reel; Series: ABLS; Accuracy: 20ppm; Length: 11.4mm; Frequency Tolerance: 20ppm; Termination: SMD/SMT; Number of Pins: 2; Radiation Hardening: No; Depth: 4.7mm; REACH SVHC: No SVHC; Contact Plating: Tin; Load Capacitance: 18pF; Case/Package: SMD/SMT; Mount: Surface Mount; Package Quantity: 1000; Max Operating Temperature: 70°C; Height: 0.165inch; Series Resistance: 80R

## Nets that join several sheets
GND: power input (C22.1 U6.10 U9.9 U9.15), MCU (23 pins)
NetC19_2: power input (C22.2 U6.9 U9.10 U9.16), MCU (C19.2 PS2.1 U16.3)
NetU9_12: power input (U9.12), MCU (U10.45)
NetU9_13: power input (U9.13), MCU (U10.44)